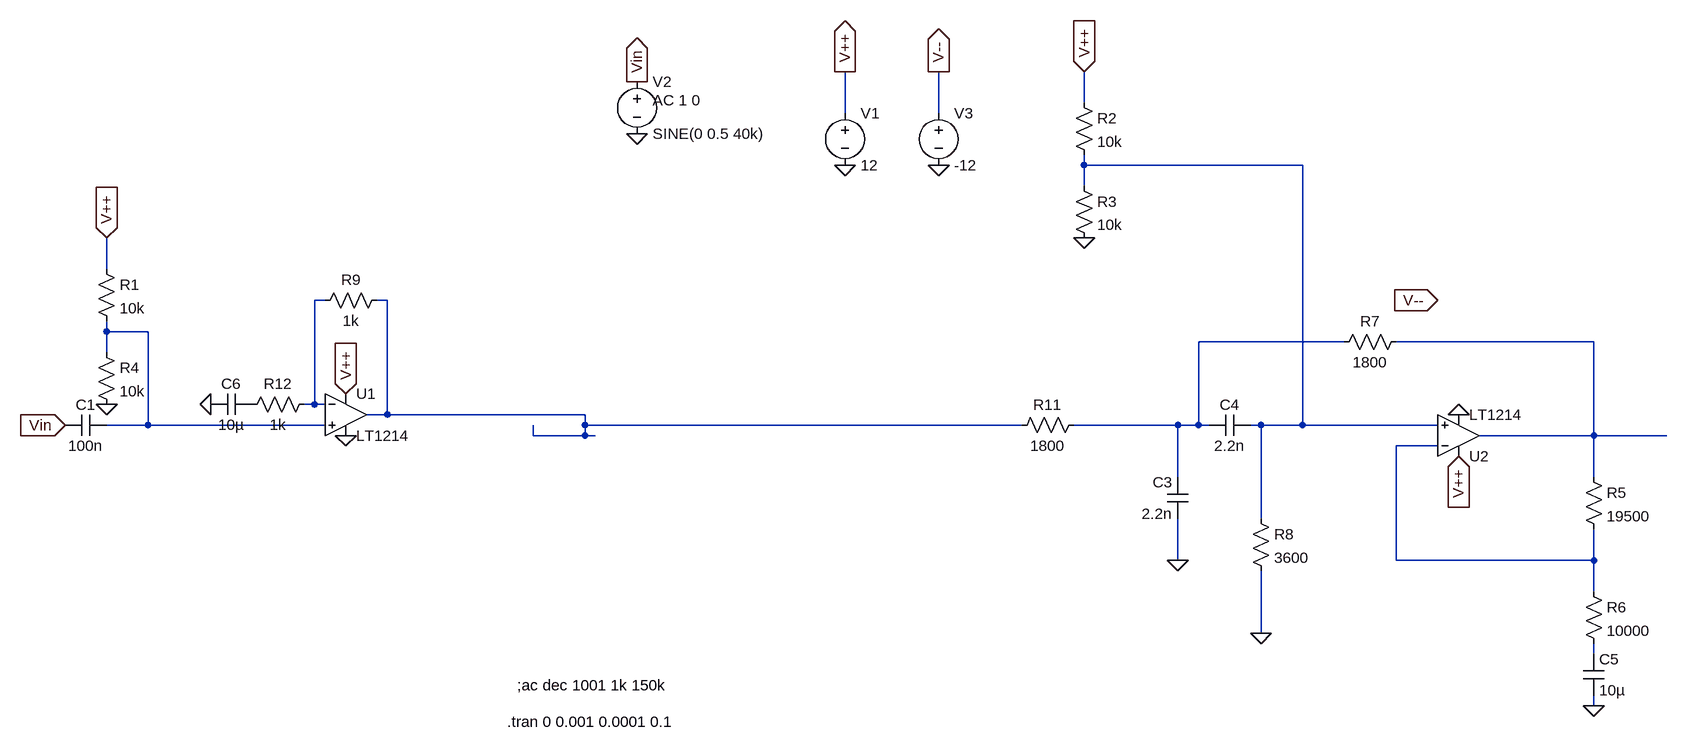
[diagram p0: schematic NewTx2.asc]
NewTx2.asc, the LTspice schematic file:
Version 4
SHEET 1 2400 796
WIRE 576 -192 576 -240
WIRE 208 -176 208 -240
WIRE 352 -176 352 -240
WIRE 576 -96 576 -112
WIRE 912 -96 576 -96
WIRE 576 -64 576 -96
WIRE -928 64 -928 16
WIRE -592 112 -608 112
WIRE -496 112 -512 112
WIRE -928 160 -928 144
WIRE -864 160 -928 160
WIRE 976 176 752 176
WIRE 1360 176 1056 176
WIRE -928 192 -928 160
WIRE -608 272 -608 112
WIRE -608 272 -624 272
WIRE -592 272 -608 272
WIRE -496 288 -496 112
WIRE -496 288 -528 288
WIRE -192 288 -496 288
WIRE -864 304 -864 160
WIRE -864 304 -928 304
WIRE -592 304 -864 304
WIRE -192 304 -192 288
WIRE 480 304 -192 304
WIRE 720 304 560 304
WIRE 752 304 752 176
WIRE 752 304 720 304
WIRE 768 304 752 304
WIRE 848 304 832 304
WIRE 912 304 912 -96
WIRE 912 304 848 304
WIRE 1120 304 912 304
WIRE -272 320 -272 304
WIRE -192 320 -192 304
WIRE -192 320 -272 320
WIRE -176 320 -192 320
WIRE 1360 320 1360 176
WIRE 1360 320 1184 320
WIRE 1472 320 1360 320
WIRE 1120 336 1056 336
WIRE 720 384 720 304
WIRE 1360 384 1360 320
WIRE 848 448 848 304
WIRE 720 512 720 448
WIRE 1056 512 1056 336
WIRE 1360 512 1360 464
WIRE 1360 512 1056 512
WIRE 1360 560 1360 512
WIRE 848 624 848 528
WIRE 1360 656 1360 640
WIRE 1360 736 1360 720
FLAG 208 -96 0
FLAG 208 -240 V++
IOPIN 208 -240 Out
FLAG -112 -144 0
FLAG -112 -224 Vin
IOPIN -112 -224 Out
FLAG 352 -96 0
FLAG 352 -240 V--
IOPIN 352 -240 Out
FLAG -560 256 V++
IOPIN -560 256 In
FLAG 576 -240 V++
IOPIN 576 -240 In
FLAG 576 16 0
FLAG -560 320 0
FLAG 720 512 0
FLAG 848 624 0
FLAG 1152 352 V++
IOPIN 1152 352 In
FLAG 1360 736 0
FLAG -928 16 V++
IOPIN -928 16 In
FLAG -928 272 0
FLAG -768 272 0
FLAG 1120 112 V--
IOPIN 1120 112 In
FLAG -992 304 Vin
IOPIN -992 304 In
FLAG 1152 288 0
SYMBOL voltage 208 -192 R0
WINDOW 123 0 0 Left 0
WINDOW 39 0 0 Left 0
SYMATTR InstName V1
SYMATTR Value 12
SYMBOL voltage -112 -240 R0
WINDOW 123 24 44 Left 2
WINDOW 39 0 0 Left 0
SYMATTR Value2 AC 1 0
SYMATTR InstName V2
SYMATTR Value SINE(0 0.5 40k)
SYMBOL voltage 352 -192 R0
WINDOW 123 0 0 Left 0
WINDOW 39 0 0 Left 0
SYMATTR InstName V3
SYMATTR Value -12
SYMBOL Opamps\\LT1214 -560 224 R0
SYMATTR InstName U1
SYMBOL res 560 -208 R0
SYMATTR InstName R2
SYMATTR Value 10k
SYMBOL res 560 -80 R0
SYMATTR InstName R3
SYMATTR Value 10k
SYMBOL cap 736 448 R180
WINDOW 0 24 56 Left 2
WINDOW 3 24 8 Left 2
SYMATTR InstName C3
SYMATTR Value 2.2n
SYMBOL res 1344 368 R0
SYMATTR InstName R5
SYMATTR Value 19500
SYMBOL res 1344 544 R0
SYMATTR InstName R6
SYMATTR Value 10000
SYMBOL res 1072 160 R90
WINDOW 0 0 56 VBottom 2
WINDOW 3 32 56 VTop 2
SYMATTR InstName R7
SYMATTR Value 1800
SYMBOL OpAmps\\LT1214 1152 384 M180
SYMATTR InstName U2
SYMBOL res 832 432 R0
SYMATTR InstName R8
SYMATTR Value 3600
SYMBOL res 576 288 R90
WINDOW 0 0 56 VBottom 2
WINDOW 3 32 56 VTop 2
SYMATTR InstName R11
SYMATTR Value 1800
SYMBOL res -944 48 R0
SYMATTR InstName R1
SYMATTR Value 10k
SYMBOL res -944 176 R0
SYMATTR InstName R4
SYMATTR Value 10k
SYMBOL cap -928 288 R90
WINDOW 0 0 32 VBottom 2
WINDOW 3 32 32 VTop 2
SYMATTR InstName C1
SYMATTR Value 100n
SYMBOL res -496 96 R90
WINDOW 0 0 56 VBottom 2
WINDOW 3 32 56 VTop 2
SYMATTR InstName R9
SYMATTR Value 1k
SYMBOL res -608 256 R90
WINDOW 0 0 56 VBottom 2
WINDOW 3 32 56 VTop 2
SYMATTR InstName R12
SYMATTR Value 1k
SYMBOL cap -704 256 R90
WINDOW 0 0 32 VBottom 2
WINDOW 3 32 32 VTop 2
SYMATTR InstName C6
SYMATTR Value 10µ
SYMBOL cap 832 288 R90
WINDOW 0 0 32 VBottom 2
WINDOW 3 32 32 VTop 2
SYMATTR InstName C4
SYMATTR Value 2.2n
SYMBOL cap 1344 656 R0
SYMATTR InstName C5
SYMATTR Value 10µ
TEXT -312 760 Left 2 !.tran 0 0.001 0.0001 0.1
TEXT -296 704 Left 2 !;ac dec 1001 1k 150k

The netlist it stands for:
* NewTx2.asc
V1 V++ 0 12
V2 Vin 0 SINE(0 0.5 40k) AC 1 0
V3 V-- 0 -12
XU1 N004 N002 V++ 0 N003 LT1213  ; LT1214, pins In+ In- V+ V- OUT
R2 V++ N001 10k
R3 N001 0 10k
C3 0 N005 2.2n
R5 N006 N007 19500
R6 N007 N008 10000
R7 N006 N005 1800
XU2 N001 N007 V++ 0 N006 LT1213  ; LT1214, pins In+ In- V+ V- OUT
R8 N001 0 3600
R11 N005 N003 1800
R1 V++ N004 10k
R4 N004 0 10k
C1 N004 Vin 100n
R9 N003 N002 1k
R12 N002 P001 1k
C6 P001 0 10µ
C4 N001 N005 2.2n
C5 N008 0 10µ
.tran 0 0.001 0.0001 0.1
;ac dec 1001 1k 150k
.lib LTC.lib
.backanno
.end